# Altium project SensorAddOn.PrjPcb
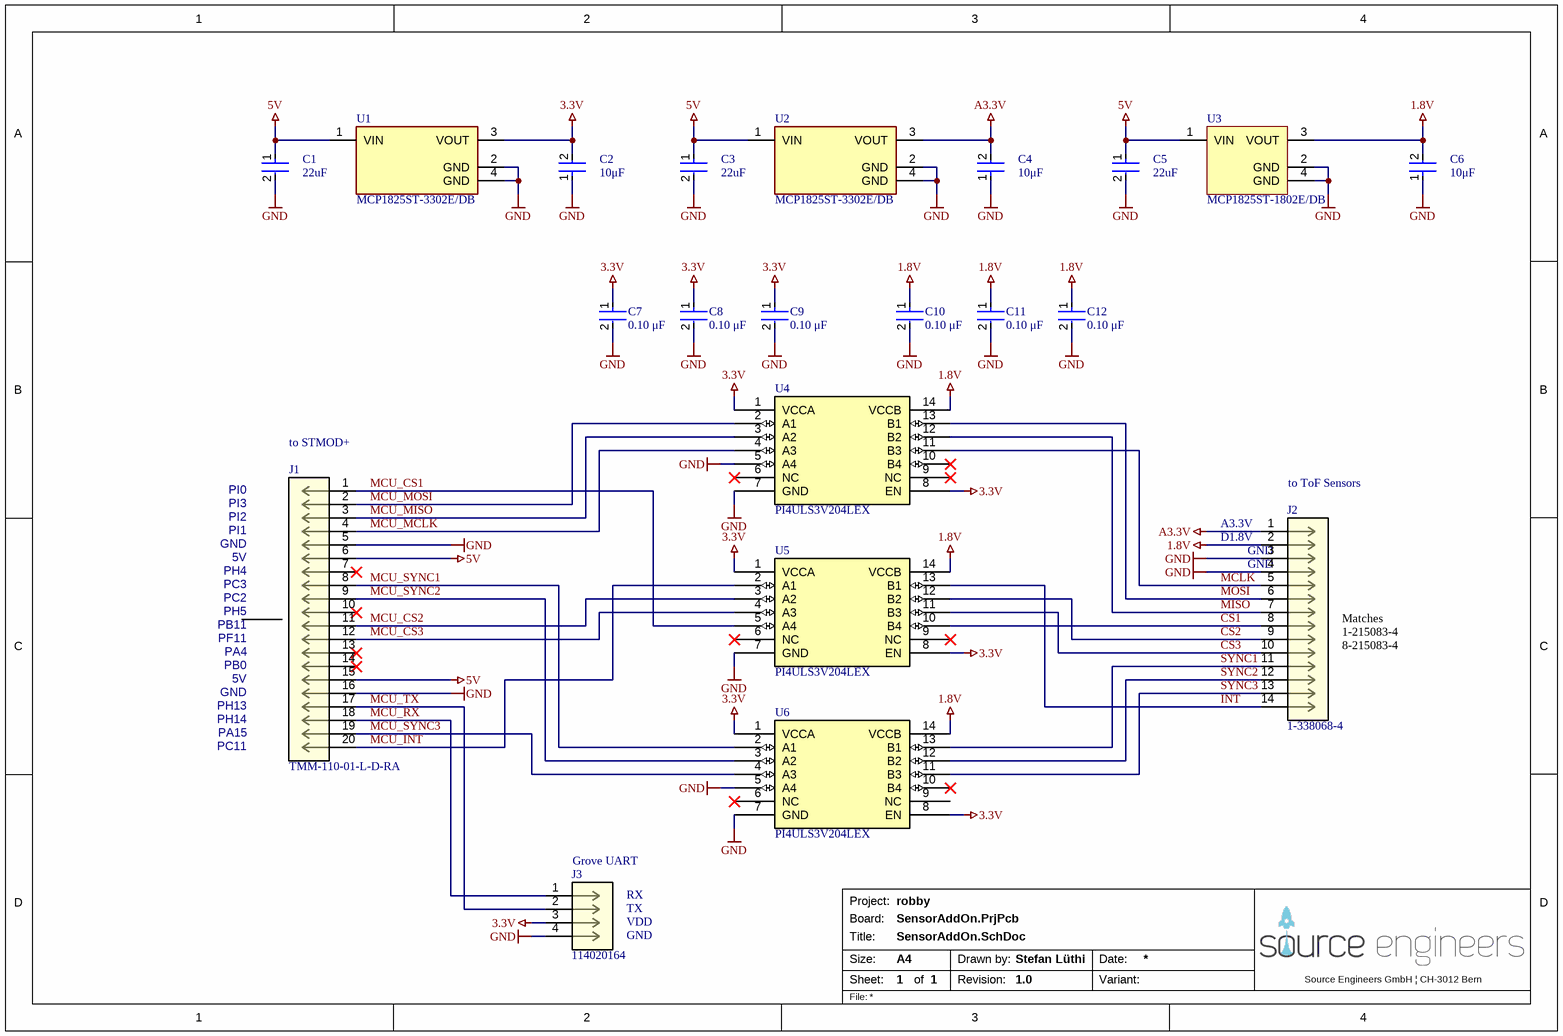
[diagram p0: SensorAddOn.SchDoc]
seAuthor: Stefan Lüthi; seProject: robby; seRevision: 1.0
1 sheet, 21 parts. Net scope: global (net labels, ports and power ports of the same name join across sheets).
Board file: SensorAddOn.PcbDoc

## Sheet SensorAddOn.SchDoc
size A4; SheetNumber: 1; SheetTotal: 1

### Parts
C1  Capacitance: 22uF  [FP-GRM319-0_15-IPC_C]  (hidden comment: GRM319R61C226ME15D)
C2  value 10μF  [FP-GRM31C-0_2-e0_3_0_8-IPC_B]  (hidden comment: GRM31CR71E106MA12K)
C3  Capacitance: 22uF  [FP-GRM319-0_15-IPC_C]  (hidden comment: GRM319R61C226ME15D)
C4  value 10μF  [FP-GRM31C-0_2-e0_3_0_8-IPC_B]  (hidden comment: GRM31CR71E106MA12K)
C5  Capacitance: 22uF  [FP-GRM319-0_15-IPC_C]  (hidden comment: GRM319R61C226ME15D)
C6  value 10μF  [FP-GRM31C-0_2-e0_3_0_8-IPC_B]  (hidden comment: GRM31CR71E106MA12K)
C7  value 0.10 μF  [FP-C0603C-CF-MFG]  (hidden comment: C0603C104M5RACTU)
C8  value 0.10 μF  [FP-C0603C-CF-MFG]  (hidden comment: C0603C104M5RACTU)
C9  value 0.10 μF  [FP-C0603C-CF-MFG]  (hidden comment: C0603C104M5RACTU)
C10  value 0.10 μF  [FP-C0603C-CF-MFG]  (hidden comment: C0603C104M5RACTU)
C11  value 0.10 μF  [FP-C0603C-CF-MFG]  (hidden comment: C0603C104M5RACTU)
C12  value 0.10 μF  [FP-C0603C-CF-MFG]  (hidden comment: C0603C104M5RACTU)
J1  TMM-110-01-L-D-RA  [CONN_TMM-110-XX-XX-D-RA_SAI]
J2  1-338068-4  [CONN_1-338068-4_TYC]
J3  114020164  [CONN4_20164_SEE]
U1  MCP1825ST-3302E/DB  [FP-C04-032-MFG]
U2  MCP1825ST-3302E/DB  [FP-C04-032-MFG]
U3  MCP1825ST-1802E/DB  [SOT-223-DB3_N]
U4  PI4ULS3V204LEX  [SOIC_3V204LEX_DIO]
U5  PI4ULS3V204LEX  [SOIC_3V204LEX_DIO]
U6  PI4ULS3V204LEX  [SOIC_3V204LEX_DIO]

### Nets
1.8V: C6.2 C10.1 C11.1 C12.1 J2.2 U3.3(VOUT) U4.14(VCCB) U5.14(VCCB) U6.14(VCCB)
3.3V: C2.2 C7.1 C8.1 C9.1 J3.3 U1.3(VOUT) U4.1(VCCA) U4.8(EN) U5.1(VCCA) U5.8(EN) U6.1(VCCA) U6.8(EN)
5V: C1.1 C3.1 C5.1 J1.6 J1.15 U1.1(VIN) U2.1(VIN) U3.1(VIN)
A3.3V: C4.2 J2.1 U2.3(VOUT)
GND: C1.2 C2.1 C3.2 C4.1 C5.2 C6.1 C7.2 C8.2 C9.2 C10.2 C11.2 C12.2 J1.5 J1.16 J2.3 J2.4 J3.4 U1.2(GND) U1.4(GND) U2.2(GND) U2.4(GND) U3.2(GND) U3.4(GND) U4.5(A4) U4.7(GND) U5.7(GND) U6.5(A4) U6.7(GND)
CS1: J2.8 U5.10(B4)
CS2: J2.9 U5.12(B2)
CS3: J2.10 U5.11(B3)
~{INT}: J2.14 U5.13(B1)
MCLK: J2.5 U4.11(B3)
MCU_CS1: J1.1 U5.5(A4)
MCU_CS2: J1.11 U5.3(A2)
MCU_CS3: J1.12 U5.4(A3)
MCU_~{INT}: J1.20 U5.2(A1)
MCU_MCLK: J1.4 U4.4(A3)
MCU_MISO: J1.3 U4.3(A2)
MCU_MOSI: J1.2 U4.2(A1)
MCU_RX: J1.18 J3.1
MCU_SYNC1: J1.8 U6.2(A1)
MCU_SYNC2: J1.9 U6.3(A2)
MCU_SYNC3: J1.19 U6.4(A3)
MCU_TX: J1.17 J3.2
MISO: J2.7 U4.12(B2)
MOSI: J2.6 U4.13(B1)
SYNC1: J2.11 U6.13(B1)
SYNC2: J2.12 U6.12(B2)
SYNC3: J2.13 U6.11(B3)

Not connected (* = marked no-connect by the designer): J1 7* 10* 13* 14*; U4 6(NC)* 9(NC)* 10(B4)*; U5 6(NC)* 9(NC)*; U6 6(NC)* 9(NC) 10(B4)*

### Notes on the sheet
- (near J1) to STMOD+
- PI0
- PI3
- PI2
- (near J2) to ToF Sensors
- PH4
- PI1
- GND
- 5V
- (near J2) A3.3V
- (near J2) D1.8V
- (near J2) GND
- PB11
- PF11
- PA4
- PC3
- PC2
- PH5
- Matches
  1-215083-4
  8-215083-4
- PB0
- PH13
- PH14
- PA15
- PC11
- (near J3) Grove UART
- RX
- TX
- VDD
- Project:
- Board:
- Title:
- Size:
- Sheet:
- A4
- of
- Drawn by:
- Revision:
- Date:
- Variant:
- Source Engineers GmbH | CH-3012 Bern
- File:

### Library data of the parts
C1 C3 C5 = CMP-06035-037955-1: Chip Multilayer Ceramic Capacitors for General Purpose, 1206, 22uF, X5R, 15%, 20%, 16V; Weight: 0.001411oz; Case/Package: 1206; Mount: Surface Mount; Voltage Rating (DC): 16V; Case Code (Metric): 3216; Height: 0.85mm; Package Quantity: 4000; Resistor Type: Ceramic; Thickness: 0.037inch; Packaging: Tape and Reel; Dielectric: X5R; Tolerance: 20%; Case Code (Imperial): 1206; Width: 0.063inch; Termination: SMD/SMT; Voltage Rating: 16V; Length: 0.126inch; Min Operating Temperature: -55°C; Max Operating Temperature: 85°C
C2 C4 C6 = CMP-06035-043219-1: Chip Multilayer Ceramic Capacitors for General Purpose, 1206, 10uF, X7R, 15%, 20%, 25V
C7-C12 = CMP-2006-03068-2: CAP CER 0.1UF 50V 20% X7R 0603; Manufacturer: KEMET; Material: Ceramic; Tolerance: 0.2; Temperature Coefficient: 30ppm/°C; Automotive Grade: Grade 1; Temperature Range High: +125°C; Voltage Rating: 50 V; Device Class L3: Ceramic Capacitors; Manufacturer Part Number: C0603C104M5RACTU; Height: 0.87mm; Category: Cap; RoHS: TRUE; Digikey Description: CAP CER 0.1UF 50V 20% X7R 0603; ComponentLink2URL: https://api.kemet.com/component-edge/download/datasheet/C0603C100J5GACAUTO.pdf; Lead Free: Yes; Temperature Range Low: -55°C; Device Class L1: Passive Components; ComponentLink2Description: Datasheet; Temperature Characteristic: X7R; Automotive: Yes; Temperature: -55°C to +125°C; Octopart: https://octopart.com/c0603c104m5ractu-kemet-11855687; Device Class L2: Capacitors; Package: C0603C-CF; Mouser Description: Multilayer Ceramic Capacitors MLCC - SMD/SMT 50volts 0.1uF X7R 20%; Capacitance: 0.10 μF
J1 = TMM-110-01-L-D-RA: No Description Available; Manufacturer_Name: Samtec Inc; Copyright: Copyright (C) 2025 Ultra Librarian. All rights reserved.; Manufacturer_Part_Number: TMM-110-01-L-D-RA; RefDes: RefDes; Type: Type; Supplier 1: DigiKey; Supplier Part Number 1: SAM10228-ND; Supplier 2: Mouser; Supplier Part Number 2: 200-TMM11001LDRA
J2 = 1-338068-4: MICRO-MATCH FTE,14P; Manufacturer_Name: TE Connectivity; Copyright: Copyright (C) 2025 Ultra Librarian. All rights reserved.; Manufacturer_Part_Number: 1-338068-4; Datasheet: https://www.te.com/commerce/DocumentDelivery/DDEController?Action=srchrtrv&DocNm=4-1773457-1_050_Micro_MaTch&DocType=Data+Sheet&DocLang=English&PartCntxt=1-338068-4&DocFormat=pdf; RefDes: RefDes; Type: Type; Supplier 1: DigiKey; Supplier Part Number 1: A99502CT-ND; Supplier 2: DigiKey; Supplier Part Number 2: A99502TR-ND; Supplier 3: Mouser; Supplier Part Number 3: 571-1-338068-4
J3 = 114020164: No Description Available; Manufacturer_Name: BeagleBoard; Copyright: Copyright (C) 2025 Ultra Librarian. All rights reserved.; Manufacturer_Part_Number: 114020164; RefDes: RefDes; Type: Type; Supplier 1: DigiKey; Supplier Part Number 1: 1597-114020164-ND; Supplier 2: Mouser; Supplier Part Number 2: 713-114020164
U1 U2 = CMP-0136-00486-2: IC REG LIN 3.3V 500MA SOT223-3; Number of Outputs: 1; Input Bias Current: 120uA; Output Type: Fixed; Max Input Voltage: 6V; Dropout Voltage: 210mV; Output Voltage Accuracy: 0.5%; Min Input Voltage: 2.1V; Quiescent Current: 220uA; Polarity: Positive; Number of Pins: 3; Output Current: 500mA; Package Quantity: 4000; Packaging: Tape and Reel; Number of Regulators: 1; Radiation Hardening: No; Min Operating Temperature: -40°C; Output Voltage: 3.3V; Case/Package: SOT-223; Mount: Surface Mount; Max Operating Temperature: 125°C
U3 = CMP-0136-00484-1: 500 mA, Low Voltage, Low Quiescent Current LDO Regulator, 3-Pin SOT-223, Extended Temperature, Tape and Reel; PackageReference: SOT-223-DB3; DatasheetVersion: revB, Feb-2008; PackageVersion: revBB, Aug-2009; PackageDescription: 3-Lead Plastic Small Outline Transistor (DB) [SOT-223]
U4-U6 = PI4ULS3V204LEX: Description; Manufacturer_Name: Diodes Inc; Copyright: Copyright (C) 2025 Ultra Librarian. All rights reserved.; Manufacturer_Part_Number: PI4ULS3V204LEX; RefDes: RefDes; Type: Type; Supplier 1: DigiKey; Supplier Part Number 1: 31-PI4ULS3V204LEXCT-ND; Supplier 2: DigiKey; Supplier Part Number 2: 31-PI4ULS3V204LEXDKR-ND; Supplier 3: DigiKey; Supplier Part Number 3: 31-PI4ULS3V204LEXTR-ND; Supplier 4: Mouser; Supplier Part Number 4: 729-PI4ULS3V204LEX